# Altium schematic sheet Memory.SchDoc
size A4; SheetNumber: 7; SheetTotal: 13
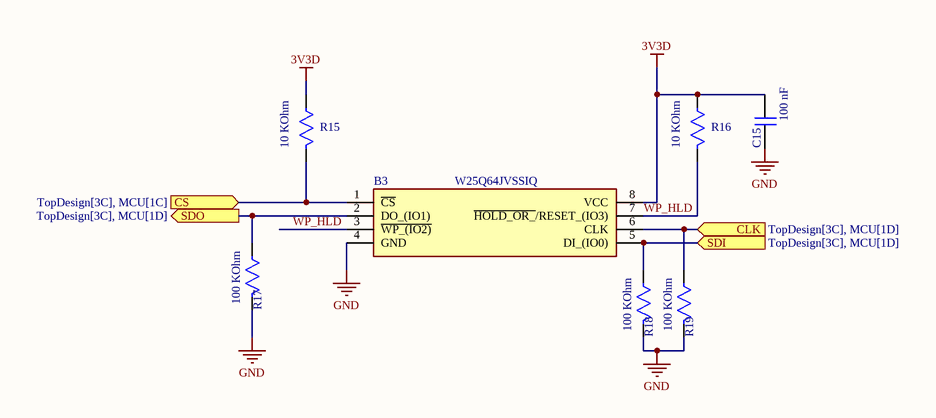
[diagram p0: Memory.SchDoc]

## Parts
B3  W25Q64JVSSIQ  [W25Q64JVSSIQ]
C15  100 nF  [CAP_0603]
R15  10 KOhm  [Res_0603]
R16  10 KOhm  [Res_0603]
R17  100 KOhm  [Res_0603]
R18  100 KOhm  [Res_0603]
R19  100 KOhm  [Res_0603]

## Ports
CLK (in, see TopDesign[3C], MCU[1D]), CS (in, see TopDesign[3C], MCU[1C]), SDI (in, see TopDesign[3C], MCU[1D]), SDO (out, see TopDesign[3C], MCU[1D])

## Nets
3V3D: B3.8(VCC) C15.2 R15.2 R16.2
GND: B3.4(GND) C15.1 R17.1 R18.1 R19.1
CLK: B3.6(CLK) R19.2 ; port CLK
CS: B3.1(~{CS}) R15.1 ; port CS
SDI: B3.5(DI_(IO0)) R18.2 ; port SDI
SDO: B3.2(DO_(IO1)) R17.2 ; port SDO
WP_HLD: B3.3(~{WP_(IO2)}) B3.7(~{HOLD_OR_}/RESET_(IO3)) R16.1

## Library data of the parts
B3 = W25Q64JVSSIQ: 64Mb Serial NOR Flash 133MHz SOP864Mbit 2.7V~3.6V 133MHz SPI SOIC-8-208mil Memory (ICs) ROHS; Manufacturer_Name: Winbond; Geometry.Height: 2.16mm; Manufacturer_Part_Number: W25Q64JVSSIQ; Datasheet Link: https://www.winbond.com/hq/search-resource-file.jsp?partNo=W25Q64JVSSIQ&type=datasheet; LCSC: C179171
C15 = Cap SMD: Cap SMD.
R15-R19 = Res smd: SMD Resistor; MP: RC0805FR-07330RL; MF: Yageo; Package: 2012 Rohm Semiconductor; Value: *; SnapEDA_Link: https://www.snapeda.com/parts/RC0805FR-07330RL/Yageo/view-part/106115/?ref=snap; Price: None; Availability: Unavailable